# Altium schematic sheet Status.SchDoc: Status LEDs
size A4; Date: 04.10.2023; ApprovedBy: M.Sc. Tobias Wirth; CheckedBy: M.Sc. Tobias Wirth; Author: M.Sc. Tobias Wirth; CompanyName: University of Stuttgart; DrawnBy: M.Sc. Tobias Wirth; Engineer: M.Sc. Tobias Wirth; Organization: IIS; Address1: Pfaffenwaldring 47; Address2: 70569 Stuttgart; Revision: V1.2; SheetNumber: 3; SheetTotal: 3; ProjectNameAlt: AUS - NMR System; Time: 19:30; ImagePath: N/A; Application_BuildNumber: N/A
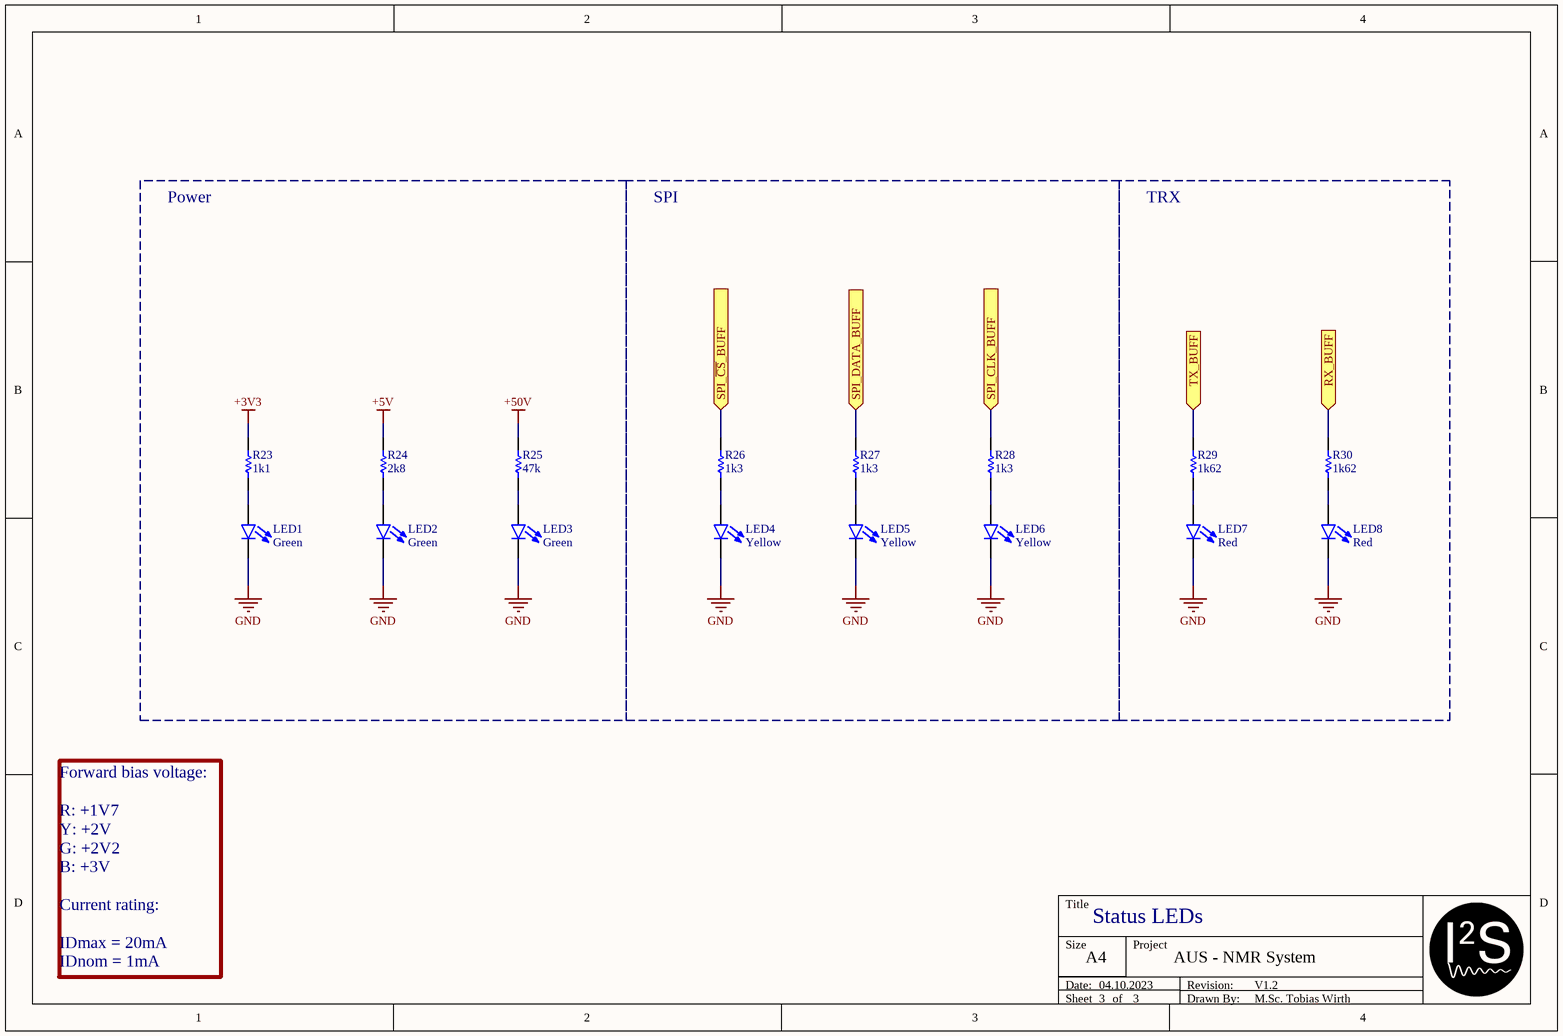
[diagram p0: Status.SchDoc]

## Parts
LED1  Green  [RES_0603]
LED2  Green  [RES_0603]
LED3  Green  [RES_0603]
LED4  Yellow  [RES_0603]
LED5  Yellow  [RES_0603]
LED6  Yellow  [RES_0603]
LED7  Red  [RES_0603]
LED8  Red  [RES_0603]
R23  1k1  [RES_0402]
R24  2k8  [RES_0402]
R25  47k  [RES_0402]
R26  1k3  [RES_0402]
R27  1k3  [RES_0402]
R28  1k3  [RES_0402]
R29  1k62  [RES_0402]
R30  1k62  [RES_0402]

## Blocks framed on the sheet
Power: LED1-LED3 R23-R25
SPI: LED4-LED6 R26-R28
TRX: LED7 LED8 R29 R30

## Ports
RX_BUFF (in), SPI_CLK_BUFF (in), SPI_DATA_BUFF (in), SPI_~{CS}_BUFF (in), TX_BUFF (in)

## Nets
+3V3: R23.2
+5V: R24.2
+50V: R25.2
GND: LED1.2 LED2.2 LED3.2 LED4.2 LED5.2 LED6.2 LED7.2 LED8.2
RX_BUFF: R30.2 ; port RX_BUFF
SPI_~{CS}_BUFF: R26.2 ; port SPI_~{CS}_BUFF
SPI_CLK_BUFF: R28.2 ; port SPI_CLK_BUFF
SPI_DATA_BUFF: R27.2 ; port SPI_DATA_BUFF
TX_BUFF: R29.2 ; port TX_BUFF
NetLED1_1: LED1.1 R23.1
NetLED2_1: LED2.1 R24.1
NetLED3_1: LED3.1 R25.1
NetLED4_1: LED4.1 R26.1
NetLED5_1: LED5.1 R27.1
NetLED6_1: LED6.1 R28.1
NetLED7_1: LED7.1 R29.1
NetLED8_1: LED8.1 R30.1

## Notes on the sheet
- Forward bias voltage:
  R: +1V7
  Y: +2V
  G: +2V2
  B: +3V
  Current rating:
  IDmax = 20mA
  IDnom = 1mA
- Title
- Size
- Date:
- Sheet
- A4
- of
- Project
- Drawn By:
- Revision:

## Library data of the parts
LED1-LED8 = LED
R23-R30 = Res: Part Number: *; Supplier: *
  R23: Value: 1k1
  R24: Value: 2k8
  R25: Value: 47k
  R26-R28: Value: 1k3
  R29 R30: Value: 1k62